# EAGLE schematic TDAR_VER_88 (EAGLE 6.5.0)
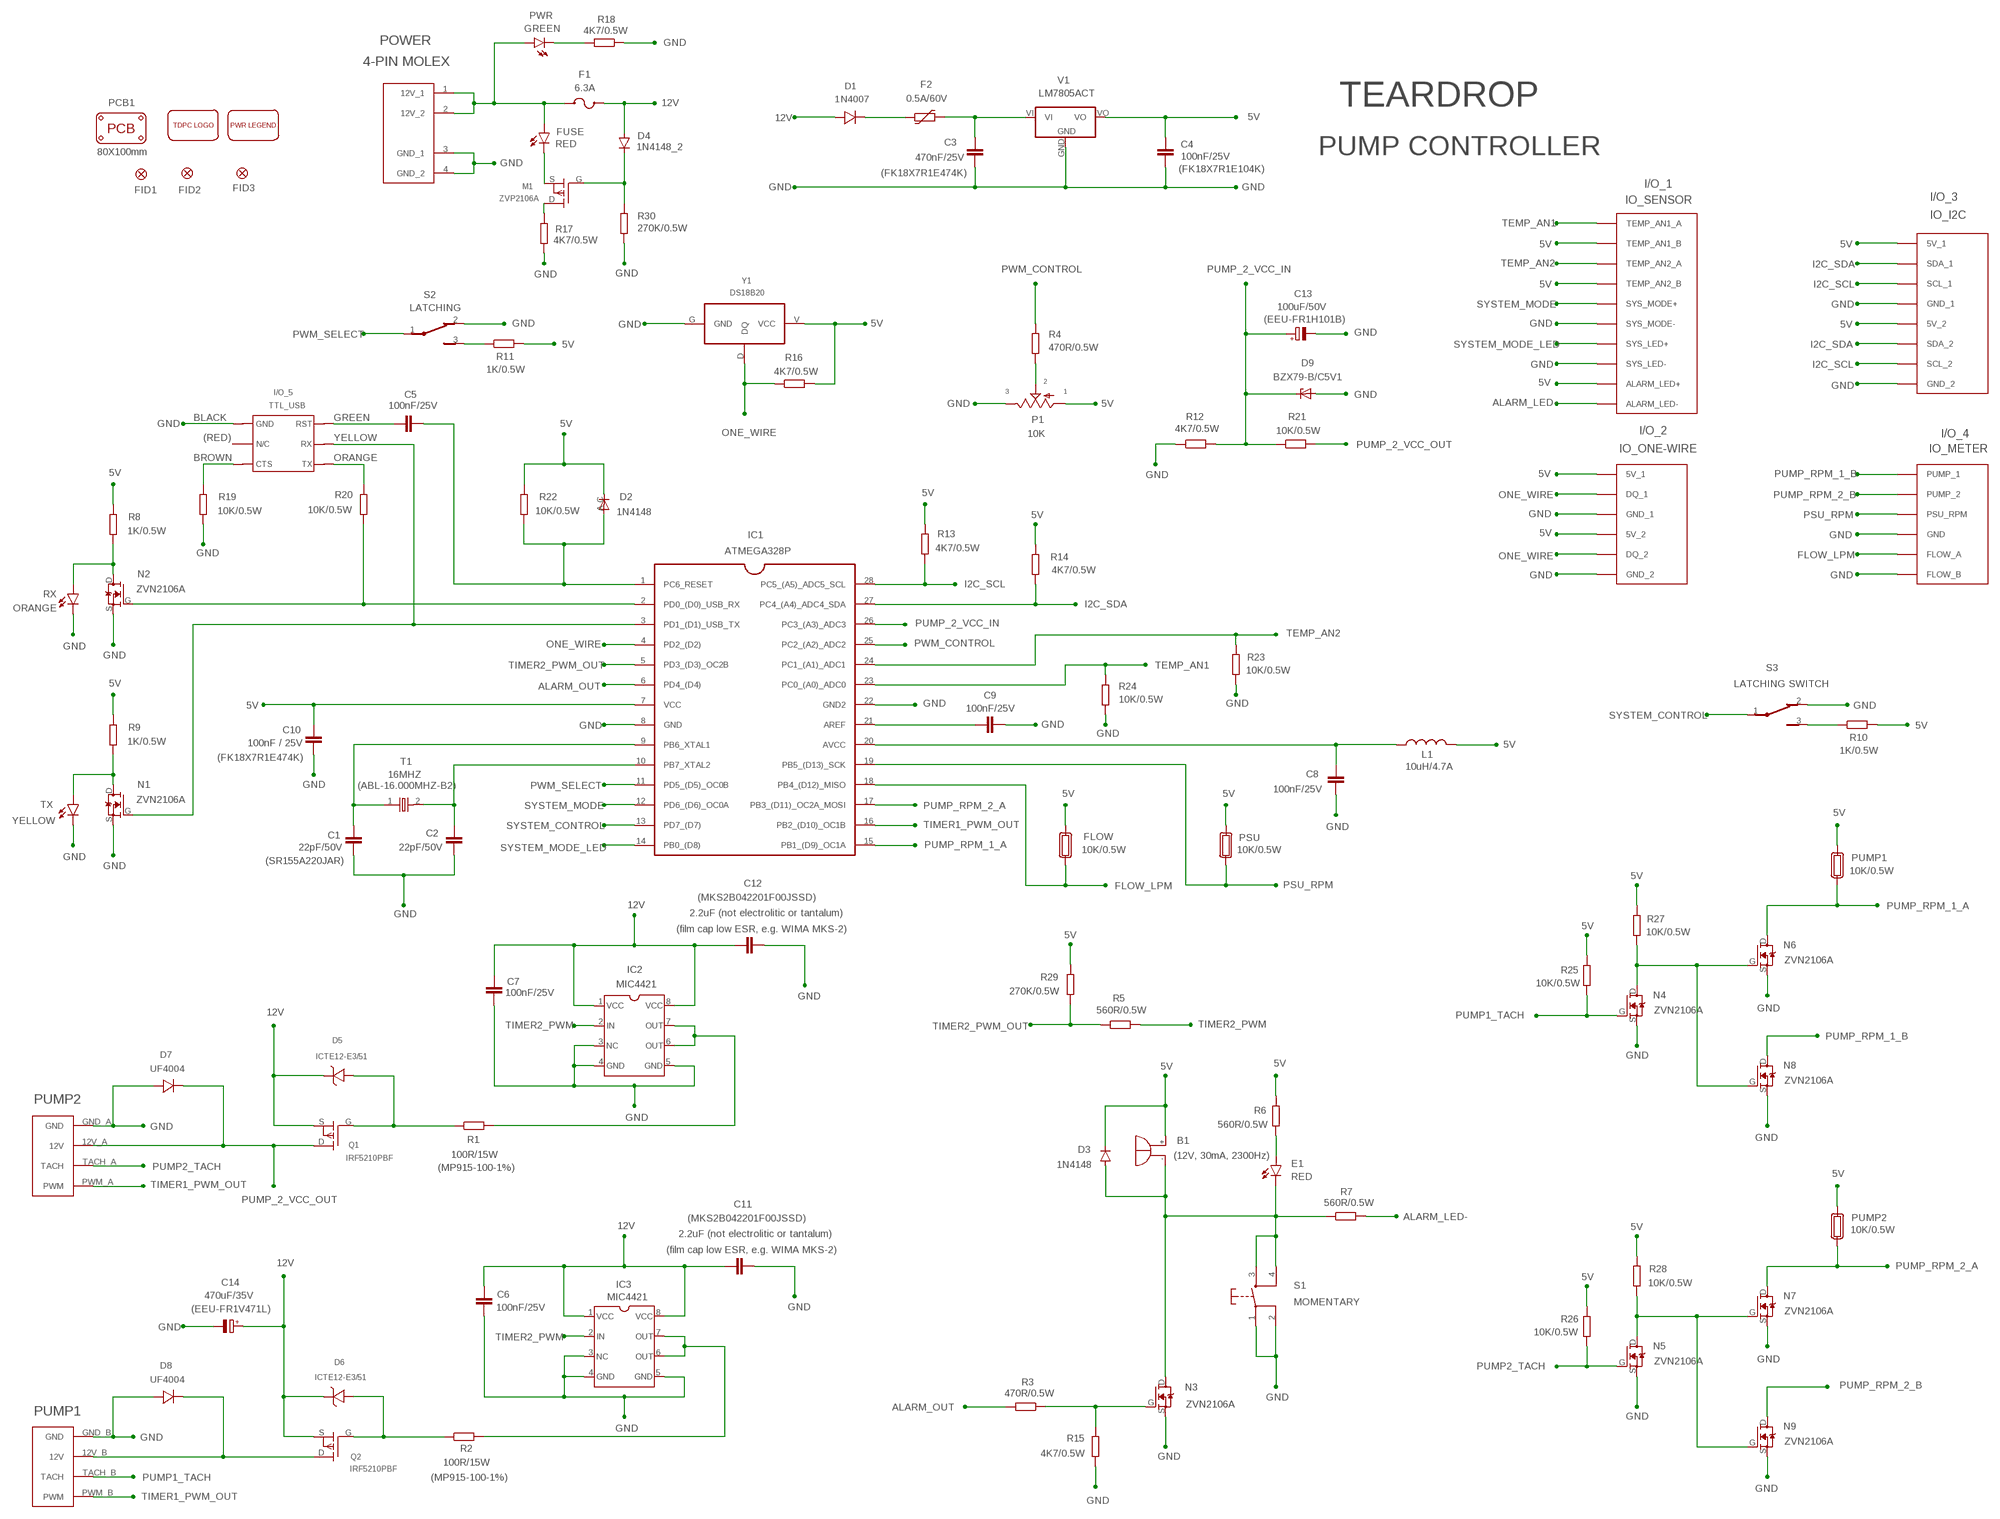
[diagram p0: schematic, sheet 1]

## Parts
B1  (12V, 30mA, 2300Hz)  F/TMB  [F/TMB]
C1  22pF/50V  MLCC_CERAMIC_12  [MLCC_CERAMIC_12]
C2  22pF/50V  MLCC_CERAMIC_11  [MLCC_CERAMIC_11]
C3  470nF/25V  MLCC_CERAMIC_8  [MLCC_CERAMIC_8]
C4  100nF/25V  MLCC_CERAMIC  [MLCC_CERAMIC]
C5  100nF/25V  MLCC_CERAMIC  [MLCC_CERAMIC]
C6  100nF/25V  MLCC_CERAMIC  [MLCC_CERAMIC]
C7  100nF/25V  MLCC_CERAMIC  [MLCC_CERAMIC]
C8  100nF/25V  MLCC_CERAMIC_7  [MLCC_CERAMIC_7]
C9  100nF/25V  MLCC_CERAMIC_7  [MLCC_CERAMIC_7]
C10  100nF / 25V  MLCC_CERAMIC_6  [MLCC_CERAMIC_6]
C11  (MKS2B042201F00JSSD)  WIMA_CAPACITOR  [WIMA_CAPACITOR]
C12  (MKS2B042201F00JSSD)  WIMA_CAPACITOR  [WIMA_CAPACITOR]
C13  100uF/50V  CPOL-EUE5-10.5  [E5-10,5]
C14  470uF/35V  CPOL-EUE5-10.5  [E5-10,5]
D1  1N4007  UF4004  [UF4004]
D2  1N4148  1N4148DO35-7  [DO35-7]
D3  1N4148  [1N4148]
D4  1N4148_2  [1N4148_2]
D5  ICTE12-E3/51  TVS_DIODE  [TVS_DIODE]
D6  ICTE12-E3/51  TVS_DIODE  [TVS_DIODE]
D7  UF4004  UF4004_2  [UF4004_2]
D8  UF4004  UF4004_2  [UF4004_2]
D9  BZX79-B/C5V1  BZX90  [DO34Z7]
E1  RED  LED_5_HORIZONTAL  [LED_5_HORIZONTAL]
F1  6.3A  FUSE_GLASS  [FUSE_GLASS]
F2  0.5A/60V  PTC  [PTC]
FID1  FIDUCIAL1X2  [FIDUCIAL-1X2]
FID2  FIDUCIAL1X2  [FIDUCIAL-1X2]
FID3  FIDUCIAL1X2  [FIDUCIAL-1X2]
FLOW  10K/0.5W  RESISTOR_SOCKET_TOP  [RESISTOR_SOCKET_TOP]
FUSE  RED  LED_1.8_LEFT  [LED_1.8_LEFT]
I/O_1  IO_SENSOR  IO_GENERAL_4  [IO_GENERAL_4]
I/O_2  IO_ONE-WIRE  [I0_ONE-WIRE]
I/O_3  IO_I2C  [IO_I2C]
I/O_4  IO_METER  IO_SENSOR_4  [IO_SENSOR_4]
I/O_5  TTL_USB  TTL_USB_7  [TTL_USB_7]
IC1  ATMEGA328P  [ATMEGA328P]
IC2  MIC4421  TC4420  [TC4420]
IC3  MIC4421  TC4420  [TC4420]
L1  10uH/4.7A  L-USIRF-24  [IRF24]
M1  ZVP2106A  [ZVP2106A]
N1  ZVN2106A  [ZVN2106A]
N2  ZVN2106A  [ZVN2106A]
N3  ZVN2106A  [ZVN2106A]
N4  ZVN2106A  [ZVN2106A]
N5  ZVN2106A  [ZVN2106A]
N6  ZVN2106A  [ZVN2106A]
N7  ZVN2106A  [ZVN2106A]
N8  ZVN2106A  [ZVN2106A]
N9  ZVN2106A  [ZVN2106A]
P1  10K  POTENTIMETER_SQUARE  [POTENTIMETER_SQUARE]
PCB1  80X100mm  PCB_DP_RECTANGLE-80X100  [DP10080_V1]
POWER  4-PIN MOLEX  MOLEX_4PIN_2  [MOLEX_4PIN_2]
PSU  10K/0.5W  RESISTOR_SOCKET_TOP  [RESISTOR_SOCKET_TOP]
PUMP1  10K/0.5W  RESISTOR_SOCKET_TOP  [RESISTOR_SOCKET_TOP]
PUMP2  10K/0.5W  RESISTOR_SOCKET_TOP  [RESISTOR_SOCKET_TOP]
PUMP_2  PUMP2  MOLEX_POWER_8_PIN_HORIZONTAL_2  [MOLEX_POWER_8_PIN_HORIZONTAL_2]
PWR  GREEN  LED_1.8_LEFT  [LED_1.8_LEFT]
Q1  IRF5210PBF  IRF5210  [IRF5210]
Q2  IRF5210PBF  IRF5210  [IRF5210]
R1  100R/15W  R-EU_V234/12  [V234/12]
R2  100R/15W  R-EU_V234/12  [V234/12]
R3  470R/0.5W  R-EU_0204/5  [0204/5]
R4  470R/0.5W  R-EU_0204/5  [0204/5]
R5  560R/0.5W  R-EU_0204/5  [0204/5]
R6  560R/0.5W  R-EU_0204/5  [0204/5]
R7  560R/0.5W  R-EU_0204/5  [0204/5]
R8  1K/0.5W  R-EU_0204/5  [0204/5]
R9  1K/0.5W  R-EU_0204/5  [0204/5]
R10  1K/0.5W  R-EU_0204/5  [0204/5]
R11  1K/0.5W  R-EU_0204/5  [0204/5]
R12  4K7/0.5W  R-EU_0204/5  [0204/5]
R13  4K7/0.5W  R-EU_0204/5  [0204/5]
R14  4K7/0.5W  R-EU_0204/5  [0204/5]
R15  4K7/0.5W  R-EU_0204/5  [0204/5]
R16  4K7/0.5W  R-EU_0204/5  [0204/5]
R17  4K7/0.5W  R-EU_0204/5  [0204/5]
R18  4K7/0.5W  R-EU_0204/5  [0204/5]
R19  10K/0.5W  R-EU_0204/5  [0204/5]
R20  10K/0.5W  R-EU_0204/5  [0204/5]
R21  10K/0.5W  R-EU_0204/5  [0204/5]
R22  10K/0.5W  R-EU_0204/5  [0204/5]
R23  10K/0.5W  R-EU_0204/5  [0204/5]
R24  10K/0.5W  R-EU_0204/5  [0204/5]
R25  10K/0.5W  R-EU_0204/5  [0204/5]
R26  10K/0.5W  R-EU_0204/5  [0204/5]
R27  10K/0.5W  R-EU_0204/5  [0204/5]
R28  10K/0.5W  R-EU_0204/5  [0204/5]
R29  270K/0.5W  R-EU_0204/5  [0204/5]
R30  270K/0.5W  R-EU_0204/5  [0204/5]
RX  ORANGE  LED_1.8_RIGHT  [LED_1.8_RIGHT]
S1  MOMENTARY  MOM_SWITCH_6.0  [MOM_SWITCH_6.0]
S2  LATCHING  SLIDING_SWITCH_5  [SLIDING_SWITCH_5]
S3  LATCHING SWITCH  SLIDING_SWITCH_4  [SLIDING_SWITCH_4]
T1  16MHZ  CRYSTAL_16MHZ  [CRYSTAL_16MHZ]
TX  YELLOW  LED_1.8_RIGHT  [LED_1.8_RIGHT]
U$1  TDPC_LOGO  [TDPC_LOGO]
U$2  MOLEX_4PIN_LEGEND  [MOLEX_4PIN_LEGEND]
V1  LM7805ACT  LM7805  [LM7805]
Y1  DS18B20  [DS18B20]

## Nets
5V: B1.+ C4.2 C10.1 D2.C D3.C FLOW.1 I/O_1.5V_1(TEMP_AN1_B) I/O_1.5V_2(TEMP_AN2_B) I/O_1.ALARM_LED+ I/O_2.5V_1 I/O_2.5V_2 I/O_3.5V_1 I/O_3.5V_2 IC1.7(VCC) L1.2 P1.1(A) PSU.1 PUMP1.1 PUMP2.1 R6.1 R8.1 R9.1 R10.2 R11.2 R13.2 R14.1 R16.2 R22.1 R25.1 R26.1 R27.1 R28.2 R29.1 V1.VO Y1.V(VCC)
12V: C6.2 C7.2 C11.1 C12.1 C14.+ D1.A D4.A D5.C D6.C F1.2 IC2.1 IC2.8 IC3.1 IC3.8 Q1.S Q2.S
ALARM_LED-: I/O_1.ALARM_LED- R7.2
ALARM_OUT: IC1.6(PD4_(D4)) R3.2
CRYSTAL_A: C1.1 IC1.9(PB6_XTAL1) T1.1
CRYSTAL_B: C2.1 IC1.10(PB7_XTAL2) T1.2
D4: D5.A Q1.G R1.1
FLOW_LPM: FLOW.2 I/O_4.FLOW_A IC1.18(PB4_(D12)_MISO)
GND: C1.2 C2.2 C3.2 C4.1 C6.1 C7.1 C8.2 C9.2 C10.2 C11.2 C12.2 C13.- C14.- D7.A D8.A D9.A I/O_1.SYSTEM_LED-(SYS_LED-) I/O_1.SYSTEM_MODE-(SYS_MODE-) I/O_2.GND_1 I/O_2.GND_2 I/O_3.GND_1 I/O_3.GND_2 I/O_4.FLOW_B I/O_4.GND I/O_5.GND IC1.8(GND) IC1.22(GND2) IC2.3 IC2.4 IC2.5 IC3.3 IC3.4 IC3.5 N1.S N2.S N3.S N4.S N5.S N6.S N7.S N8.S N9.S P1.3(E) POWER.3(GND_1) POWER.4(GND_2) PUMP_2.GND_A(GND) PUMP_2.GND_B(GND) R12.1 R15.1 R17.2 R18.1 R19.2 R23.1 R24.2 R30.2 RX.K(C) S1.1 S1.2 S2.2 S3.2 TX.K(C) V1.GND Y1.G(GND)
I2C_SCL: I/O_3.SCL_1 I/O_3.SCL_2 IC1.28(PC5_(A5)_ADC5_SCL) R13.1
I2C_SDA: I/O_3.SDA_1 I/O_3.SDA_2 IC1.27(PC4_(A4)_ADC4_SDA) R14.2
N$1: R11.1 S2.3
N$4: D4.C M1.G R30.1
N$7: C8.1 IC1.20(AVCC) L1.1
N$8: PWR.K(C) R18.2
N$10: P1.2(S) R4.1
N$11: IC2.6 IC2.7 R1.2
N$12: D6.A Q2.G R2.1
N$13: IC3.6 IC3.7 R2.2
N$14: FUSE.K(C) M1.S
N$16: N4.D N6.G N8.G R27.2
N$17: C9.1 IC1.21(AREF)
N$19: N3.G R3.1 R15.2
N$20: R10.1 S3.3
N$22: D1.C F2.1
N$23: N1.D R9.2 TX.A
N$24: N2.D R8.2 RX.A
N$25: M1.D R17.1
N$29: E1.A R6.2
N$36: N5.D N7.G N9.G R28.1
N$100: B1.- D3.A E1.K(C) N3.D R7.1 S1.3 S1.4
ONE_WIRE: I/O_2.DQ_1 I/O_2.DQ_2 IC1.4(PD2_(D2)) R16.1 Y1.D(DQ)
POST_FUSE: C3.1 F2.2 V1.VI
PSU_RPM: I/O_4.PSU(PSU_RPM) IC1.19(PB5_(D13)_SCK) PSU.2
PUMP1_TACH: N4.G PUMP_2.TACH_B(TACH) R25.2
PUMP2_TACH: N5.G PUMP_2.TACH_A(TACH) R26.2
PUMP_1_VCC_OUT: D8.C PUMP_2.12V_B(12V) Q2.D
PUMP_2_VCC_IN: C13.+ D9.C IC1.26(PC3_(A3)_ADC3) R12.2 R21.1
PUMP_2_VCC_OUT: D7.C PUMP_2.12V_A(12V) Q1.D R21.2
PUMP_RPM_1_A: IC1.15(PB1_(D9)_OC1A) N6.D PUMP1.2
PUMP_RPM_1_B: I/O_4.PUMP_1 N8.D
PUMP_RPM_2_A: IC1.17(PB3_(D11)_OC2A_MOSI) N7.D PUMP2.2
PUMP_RPM_2_B: I/O_4.PUMP_2 N9.D
PWM_CONTROL: IC1.25(PC2_(A2)_ADC2) R4.2
PWM_SELECT: IC1.11(PD5_(D5)_OC0B) S2.1
PWR_IN: F1.1 FUSE.A POWER.1(12V_1) POWER.2(12V_2) PWR.A
RESET: C5.1 D2.A IC1.1(PC6_RESET) R22.2
SYSTEM_CONTROL: IC1.13(PD7_(D7)) S3.1
SYSTEM_MODE: I/O_1.SYSTEM_MODE+(SYS_MODE+) IC1.12(PD6_(D6)_OC0A)
SYSTEM_MODE_LED: I/O_1.SYSTEM_LED+(SYS_LED+) IC1.14(PB0_(D8))
TEMP_AN1: I/O_1.TEMP_AN1(TEMP_AN1_A) IC1.23(PC0_(A0)_ADC0) R24.1
TEMP_AN2: I/O_1.TEMP_AN2(TEMP_AN2_A) IC1.24(PC1_(A1)_ADC1) R23.2
TIMER1_PWM_OUT: IC1.16(PB2_(D10)_OC1B) PUMP_2.PWM_A(PWM) PUMP_2.PWM_B(PWM)
TIMER2_PWM: IC2.2 IC3.2 R5.2
TIMER2_PWM_OUT: IC1.5(PD3_(D3)_OC2B) R5.1 R29.2
USB_CTS: I/O_5.CTS R19.1
USB_RESET_2: C5.2 I/O_5.RST
USB_RX: IC1.2(PD0_(D0)_USB_RX) N2.G R20.2
USB_RX_2: I/O_5.TX R20.1
USB_TX: I/O_5.RX IC1.3(PD1_(D1)_USB_TX) N1.G

## Notes on the sheet
- TEARDROP
- PUMP CONTROLLER
- (FK18X7R1E104K)
- (FK18X7R1E474K)
- FID1 | FID2 | FID3
- (EEU-FR1H101B)
- BLACK | GREEN
- (RED) | YELLOW
- BROWN | ORANGE
- (FK18X7R1E474K)
- (ABL-16.000MHZ-B2)
- (SR155A220JAR)
- 2.2uF (not electrolitic or tantalum)
- (film cap low ESR, e.g. WIMA MKS-2)
- (MP915-100-1%)
- 2.2uF (not electrolitic or tantalum)
- (film cap low ESR, e.g. WIMA MKS-2)
- (EEU-FR1V471L)
- PUMP1
- (MP915-100-1%)

## Library data of the parts
B1 = BUZZER (12v) - VER. 2.0:F/TMB: BUZZER Source: Buerklin; OC_FARNELL: unknown; OC_NEWARK: unknown
C1 = MLCC_CERAMIC (CAPACITOR):MLCC_CERAMIC_12
C2 = MLCC_CERAMIC (CAPACITOR):MLCC_CERAMIC_11
C3 = MLCC_CERAMIC (CAPACITOR):MLCC_CERAMIC_8
C4-C7 = MLCC_CERAMIC (CAPACITOR):MLCC_CERAMIC
C8 C9 = MLCC_CERAMIC (CAPACITOR):MLCC_CERAMIC_7
C10 = MLCC_CERAMIC (CAPACITOR):MLCC_CERAMIC_6
C11 C12 = WIMA_CAPACITOR:WIMA_CAPACITOR
C13 C14 = CAPACITOR_470uF_50V_8mm:CPOL-EU: POLARIZED CAPACITOR, European symbol
D1 = UF4004:UF4004
D2 = DIODE (1N4148) - VER. 5.0:1N4148: DIODE high speed (Philips)
D3 = 1N4148:1N4148
D4 = 1N4148:1N4148_2
D5 D6 = TVS DIODE ((ICTE12-E3-51):TVS_DIODE
D7 D8 = UF4004:UF4004_2
D9 = ZENER DIODE (BZX79) - VER. 5.0:BZX90: Z DIODE
E1 = LED_5:LED_5_HORIZONTAL
F1 = FUSE (GLASS):FUSE_GLASS
F2 = PTC:PTC
FID1-FID3 = SparkFun-Aesthetics:FIDUCIAL: Fiducial Alignment Points Various fiducial points for machine vision alignment.
FLOW PSU PUMP1 PUMP2 = RESISTOR_SOCKET:RESISTOR_SOCKET_TOP
FUSE PWR = LED_1.8:LED_1.8_LEFT
I/O_1 = IO_4-PIN:IO_GENERAL_4
I/O_2 = IO_3-PIN:IO_ONE-WIRE
I/O_3 = IO_4-PIN:IO_I2C
I/O_4 = IO_4-PIN:IO_SENSOR_4
I/O_5 = TTL_USB:TTL_USB_7
IC1 = ATMEGA328P_VER_2.0:ATMEGA328P
IC2 IC3 = TC4420:TC4420
L1 = INDUCTOR (10uH, 4.7A):L-US: INDUCTOR, American symbol
M1 = ZVP2106A:ZVP2106A
N1-N9 = ZVN2106A:ZVN2106A
P1 = POTENTIMETER_SQUARE:POTENTIMETER_SQUARE
PCB1 = PCB_TEMPLATES - VER. 4.0:PCB_DP_RECTANGLE: Dangerous Prototypes Standard Rectangular PCB sizes; PCB_SIZE: DP10080_V1
POWER = POWER HEADER (MOLEX_4 PIN):MOLEX_4PIN_2
PUMP_2 = MOLEX POWER (8 PIN, HORIZONTAL) - VER. 4.0:MOLEX_POWER_8_PIN_HORIZONTAL_2
Q1 Q2 = MOSFET (IRF5210PBF):IRF5210
R1 R2 = RESISTOR (100R, 15W, TO-126):R-EU_: RESISTOR, European symbol
R3-R30 = RESISTOR (REGULAR, 0.25W):R-EU_: RESISTOR, European symbol
RX TX = LED_1.8:LED_1.8_RIGHT
S1 = MOMENTARY SWITCH - VER. 6.0:MOM_SWITCH_6.0
S2 = SLIDING_SWITCH:SLIDING_SWITCH_5
S3 = SLIDING_SWITCH:SLIDING_SWITCH_4
T1 = CRYSTAL_16MHZ:CRYSTAL_16MHZ
U$1 = TDPC_LOGO:TDPC_LOGO
U$2 = POWER HEADER (MOLEX_4 PIN):MOLEX_4PIN_LEGEND
V1 = LM7805:LM7805
Y1 = DS18B20:DS18B20

## Net classes
0 default: clearance 0.355 mm